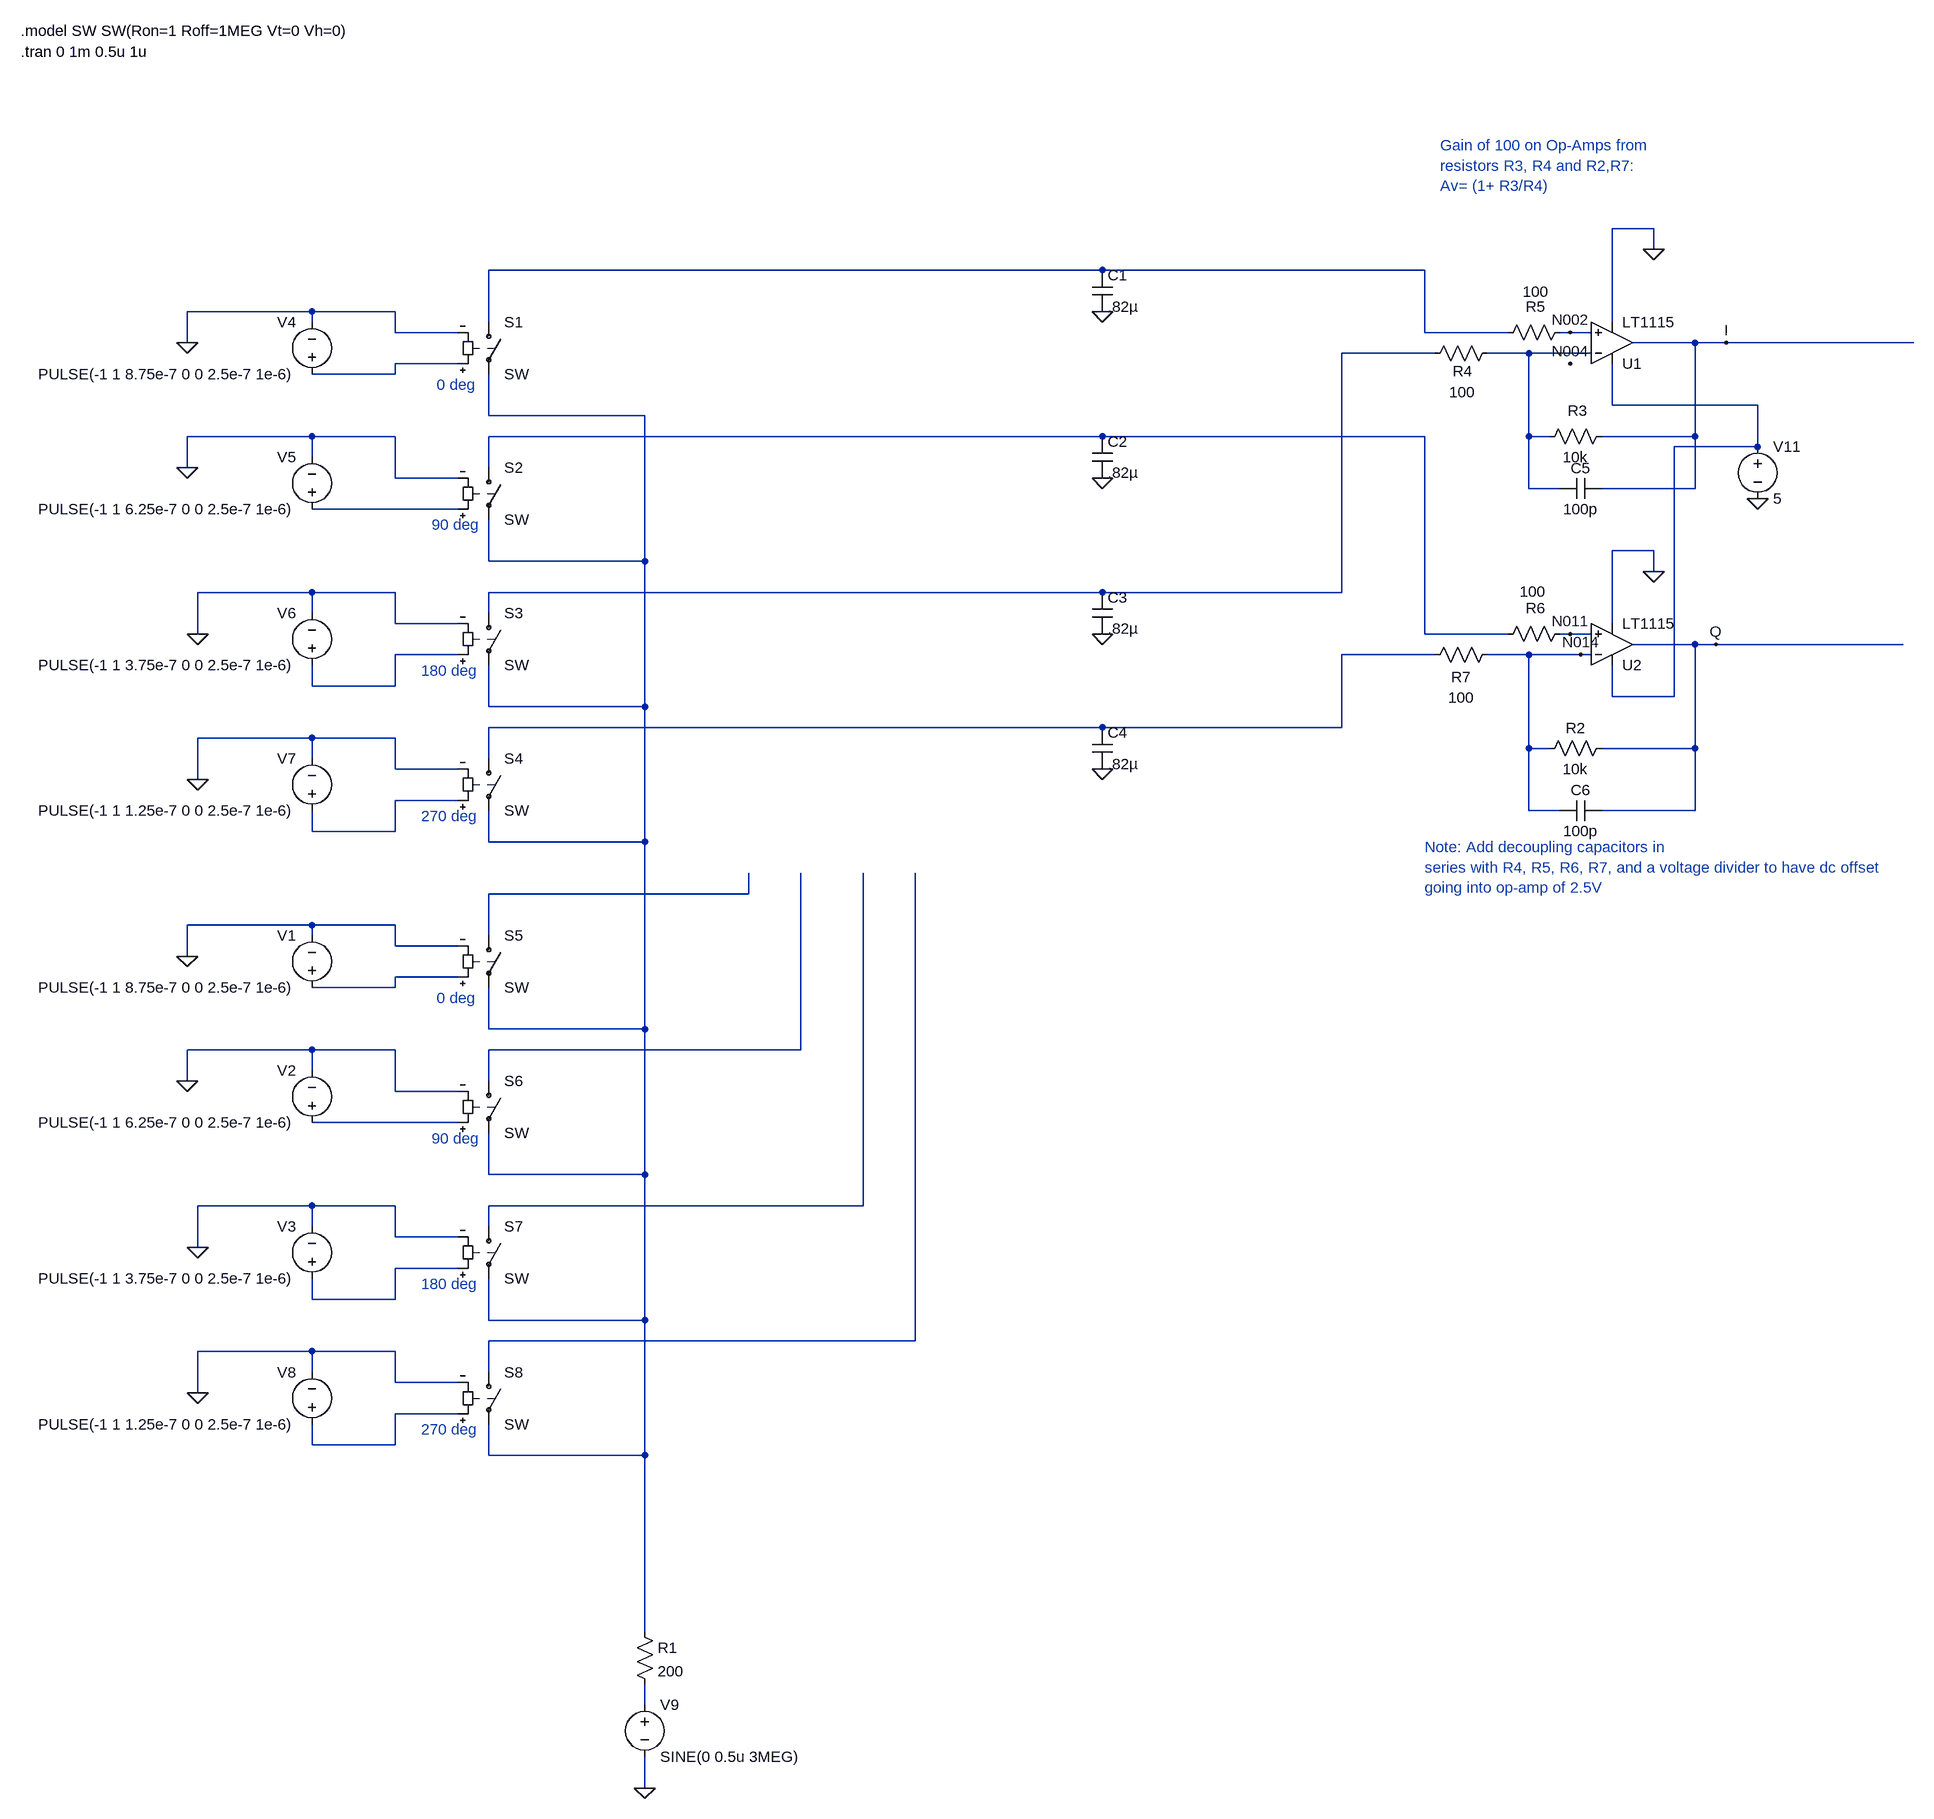
[diagram p0: schematic TayloeMixerSim.asc]
TayloeMixerSim.asc, the LTspice schematic file:
Version 4
SHEET 1 2408 2240
WIRE 1200 -176 1136 -176
WIRE 1200 -144 1200 -176
WIRE 352 -112 -592 -112
WIRE 848 -112 352 -112
WIRE -864 -48 -1056 -48
WIRE -736 -48 -864 -48
WIRE -864 -32 -864 -48
WIRE -592 -32 -592 -112
WIRE 1136 -32 1136 -176
WIRE -736 -16 -736 -48
WIRE -640 -16 -736 -16
WIRE 848 -16 848 -112
WIRE 976 -16 848 -16
WIRE 1072 -16 1056 -16
WIRE 1104 -16 1072 -16
WIRE -1056 0 -1056 -48
WIRE 1264 0 1168 0
WIRE 1312 0 1264 0
WIRE 1600 0 1312 0
WIRE 864 16 720 16
WIRE 1008 16 944 16
WIRE 1104 16 1008 16
WIRE -640 32 -736 32
WIRE -736 48 -736 32
WIRE -736 48 -864 48
WIRE 1136 96 1136 32
WIRE 1360 96 1136 96
WIRE -592 112 -592 48
WIRE -352 112 -592 112
WIRE -864 144 -1056 144
WIRE -736 144 -864 144
WIRE 352 144 -592 144
WIRE 848 144 352 144
WIRE 1008 144 1008 16
WIRE 1040 144 1008 144
WIRE 1264 144 1264 0
WIRE 1264 144 1120 144
WIRE 1360 160 1360 96
WIRE 1360 160 1232 160
WIRE -864 176 -864 144
WIRE -1056 192 -1056 144
WIRE -592 192 -592 144
WIRE -736 208 -736 144
WIRE -640 208 -736 208
WIRE 1008 224 1008 144
WIRE 1056 224 1008 224
WIRE 1264 224 1264 144
WIRE 1264 224 1120 224
WIRE -640 256 -864 256
WIRE 1200 320 1136 320
WIRE -592 336 -592 272
WIRE -352 336 -352 112
WIRE -352 336 -592 336
WIRE 1200 352 1200 320
WIRE -864 384 -1040 384
WIRE -736 384 -864 384
WIRE 352 384 -592 384
WIRE 720 384 720 16
WIRE 720 384 352 384
WIRE -864 416 -864 384
WIRE -592 416 -592 384
WIRE -736 432 -736 384
WIRE -640 432 -736 432
WIRE 1136 432 1136 320
WIRE -1040 448 -1040 384
WIRE 848 448 848 144
WIRE 976 448 848 448
WIRE 1072 448 1056 448
WIRE 1104 448 1072 448
WIRE 1264 464 1168 464
WIRE 1296 464 1264 464
WIRE 1584 464 1296 464
WIRE -640 480 -736 480
WIRE 864 480 720 480
WIRE 1008 480 944 480
WIRE 1088 480 1008 480
WIRE 1104 480 1088 480
WIRE -864 528 -864 496
WIRE -736 528 -736 480
WIRE -736 528 -864 528
WIRE 1136 544 1136 496
WIRE 1232 544 1232 160
WIRE 1232 544 1136 544
WIRE -592 560 -592 496
WIRE -352 560 -352 336
WIRE -352 560 -592 560
WIRE 352 592 -592 592
WIRE 720 592 720 480
WIRE 720 592 352 592
WIRE -864 608 -1040 608
WIRE -736 608 -864 608
WIRE 1008 624 1008 480
WIRE 1040 624 1008 624
WIRE 1264 624 1264 464
WIRE 1264 624 1120 624
WIRE -864 640 -864 608
WIRE -592 640 -592 592
WIRE -736 656 -736 608
WIRE -640 656 -736 656
WIRE -1040 672 -1040 608
WIRE -640 704 -736 704
WIRE 1008 720 1008 624
WIRE 1056 720 1008 720
WIRE 1264 720 1264 624
WIRE 1264 720 1120 720
WIRE -864 752 -864 720
WIRE -736 752 -736 704
WIRE -736 752 -864 752
WIRE -592 768 -592 720
WIRE -352 768 -352 560
WIRE -352 768 -592 768
WIRE -192 848 -192 816
WIRE -192 848 -592 848
WIRE -864 896 -1056 896
WIRE -736 896 -864 896
WIRE -864 912 -864 896
WIRE -592 912 -592 848
WIRE -736 928 -736 896
WIRE -640 928 -736 928
WIRE -1056 944 -1056 896
WIRE -640 976 -736 976
WIRE -736 992 -736 976
WIRE -736 992 -864 992
WIRE -592 1056 -592 992
WIRE -352 1056 -352 768
WIRE -352 1056 -592 1056
WIRE -864 1088 -1056 1088
WIRE -736 1088 -864 1088
WIRE -112 1088 -112 816
WIRE -112 1088 -592 1088
WIRE -864 1120 -864 1088
WIRE -1056 1136 -1056 1088
WIRE -592 1136 -592 1088
WIRE -736 1152 -736 1088
WIRE -640 1152 -736 1152
WIRE -640 1200 -864 1200
WIRE -592 1280 -592 1216
WIRE -352 1280 -352 1056
WIRE -352 1280 -592 1280
WIRE -864 1328 -1040 1328
WIRE -736 1328 -864 1328
WIRE -16 1328 -16 816
WIRE -16 1328 -592 1328
WIRE -864 1360 -864 1328
WIRE -592 1360 -592 1328
WIRE -736 1376 -736 1328
WIRE -640 1376 -736 1376
WIRE -1040 1392 -1040 1328
WIRE -640 1424 -736 1424
WIRE -864 1472 -864 1440
WIRE -736 1472 -736 1424
WIRE -736 1472 -864 1472
WIRE -592 1504 -592 1440
WIRE -352 1504 -352 1280
WIRE -352 1504 -592 1504
WIRE 64 1536 64 816
WIRE 64 1536 -592 1536
WIRE -864 1552 -1040 1552
WIRE -736 1552 -864 1552
WIRE -864 1584 -864 1552
WIRE -592 1584 -592 1536
WIRE -736 1600 -736 1552
WIRE -640 1600 -736 1600
WIRE -1040 1616 -1040 1552
WIRE -640 1648 -736 1648
WIRE -864 1696 -864 1664
WIRE -736 1696 -736 1648
WIRE -736 1696 -864 1696
WIRE -592 1712 -592 1664
WIRE -352 1712 -352 1504
WIRE -352 1712 -592 1712
WIRE -352 1984 -352 1712
WIRE -352 2096 -352 2064
WIRE -352 2224 -352 2176
FLAG -1056 0 0
FLAG -1056 192 0
FLAG -1040 448 0
FLAG -1040 672 0
FLAG -1056 944 0
FLAG -1056 1136 0
FLAG -1040 1392 0
FLAG -1040 1616 0
FLAG -352 2224 0
FLAG 352 -48 0
FLAG 352 208 0
FLAG 352 448 0
FLAG 352 656 0
FLAG 1360 240 0
FLAG 1200 352 0
FLAG 1200 -144 0
FLAG 1296 464 Q
FLAG 1312 0 I
FLAG 1072 -16 N002
FLAG 1072 32 N004
FLAG 1072 448 N011
FLAG 1088 480 N014
SYMBOL sw -592 -48 R0
SYMATTR InstName S1
SYMBOL sw -592 176 R0
SYMATTR InstName S2
SYMBOL sw -592 400 R0
SYMATTR InstName S3
SYMBOL sw -592 624 R0
SYMATTR InstName S4
SYMBOL voltage -864 64 R180
WINDOW 0 24 96 Left 2
WINDOW 3 24 16 Left 2
SYMATTR InstName V4
SYMATTR Value PULSE(-1 1 8.75e-7 0 0 2.5e-7 1e-6)
SYMBOL voltage -864 272 R180
WINDOW 0 24 96 Left 2
WINDOW 3 24 16 Left 2
SYMATTR InstName V5
SYMATTR Value PULSE(-1 1 6.25e-7 0 0 2.5e-7 1e-6)
SYMBOL voltage -864 512 R180
WINDOW 0 24 96 Left 2
WINDOW 3 24 16 Left 2
SYMATTR InstName V6
SYMATTR Value PULSE(-1 1 3.75e-7 0 0 2.5e-7 1e-6)
SYMBOL voltage -864 736 R180
WINDOW 0 24 96 Left 2
WINDOW 3 24 16 Left 2
SYMATTR InstName V7
SYMATTR Value PULSE(-1 1 1.25e-7 0 0 2.5e-7 1e-6)
SYMBOL sw -592 896 R0
SYMATTR InstName S5
SYMBOL sw -592 1120 R0
SYMATTR InstName S6
SYMBOL sw -592 1344 R0
SYMATTR InstName S7
SYMBOL sw -592 1568 R0
SYMATTR InstName S8
SYMBOL voltage -864 1008 R180
WINDOW 0 24 96 Left 2
WINDOW 3 24 16 Left 2
SYMATTR InstName V1
SYMATTR Value PULSE(-1 1 8.75e-7 0 0 2.5e-7 1e-6)
SYMBOL voltage -864 1216 R180
WINDOW 0 24 96 Left 2
WINDOW 3 24 16 Left 2
SYMATTR InstName V2
SYMATTR Value PULSE(-1 1 6.25e-7 0 0 2.5e-7 1e-6)
SYMBOL voltage -864 1456 R180
WINDOW 0 24 96 Left 2
WINDOW 3 24 16 Left 2
SYMATTR InstName V3
SYMATTR Value PULSE(-1 1 3.75e-7 0 0 2.5e-7 1e-6)
SYMBOL voltage -864 1680 R180
WINDOW 0 24 96 Left 2
WINDOW 3 24 16 Left 2
SYMATTR InstName V8
SYMATTR Value PULSE(-1 1 1.25e-7 0 0 2.5e-7 1e-6)
SYMBOL voltage -352 2080 R0
SYMATTR InstName V9
SYMATTR Value SINE(0 0.5u 3MEG)
SYMBOL res -368 1968 R0
SYMATTR InstName R1
SYMATTR Value 200
SYMBOL cap 336 -112 R0
SYMATTR InstName C1
SYMATTR Value .82µ
SYMBOL cap 336 144 R0
SYMATTR InstName C2
SYMATTR Value .82µ
SYMBOL cap 336 384 R0
SYMATTR InstName C3
SYMATTR Value .82µ
SYMBOL cap 336 592 R0
SYMATTR InstName C4
SYMATTR Value .82µ
SYMBOL res 1136 608 R90
WINDOW 0 0 56 VBottom 2
WINDOW 3 32 56 VTop 2
SYMATTR InstName R2
SYMATTR Value 10k
SYMBOL res 1136 128 R90
WINDOW 0 -8 53 VBottom 2
WINDOW 3 32 56 VTop 2
SYMATTR InstName R3
SYMATTR Value 10k
SYMBOL res 960 0 R90
WINDOW 0 59 54 VBottom 2
WINDOW 3 60 54 VTop 2
SYMATTR InstName R4
SYMATTR Value 100
SYMBOL res 1072 -32 R90
WINDOW 0 -8 53 VBottom 2
WINDOW 3 -62 53 VTop 2
SYMATTR InstName R5
SYMATTR Value 100
SYMBOL res 1072 432 R90
WINDOW 0 -8 53 VBottom 2
WINDOW 3 -65 58 VTop 2
SYMATTR InstName R6
SYMATTR Value 100
SYMBOL res 960 464 R90
WINDOW 0 66 56 VBottom 2
WINDOW 3 66 56 VTop 2
SYMATTR InstName R7
SYMATTR Value 100
SYMBOL voltage 1360 144 R0
SYMATTR InstName V11
SYMATTR Value 5
SYMBOL cap 1120 208 R90
WINDOW 0 0 32 VBottom 2
WINDOW 3 32 32 VTop 2
SYMATTR InstName C5
SYMATTR Value 100p
SYMBOL cap 1120 704 R90
WINDOW 0 0 32 VBottom 2
WINDOW 3 32 32 VTop 2
SYMATTR InstName C6
SYMATTR Value 100p
SYMBOL Opamps/LT1115 1136 64 M180
SYMATTR InstName U1
SYMBOL Opamps/LT1115 1136 528 M180
SYMATTR InstName U2
TEXT -672 64 Left 2 ;0 deg
TEXT -680 280 Left 2 ;90 deg
TEXT -696 504 Left 2 ;180 deg
TEXT -696 728 Left 2 ;270 deg
TEXT -1312 -480 Left 2 !.model SW SW(Ron=1 Roff=1MEG Vt=0 Vh=0)
TEXT -1312 -448 Left 2 !.tran 0 1m 0.5u 1u
TEXT -672 1008 Left 2 ;0 deg
TEXT -680 1224 Left 2 ;90 deg
TEXT -696 1448 Left 2 ;180 deg
TEXT -696 1672 Left 2 ;270 deg
TEXT 872 -304 Left 2 ;Gain of 100 on Op-Amps from \nresistors R3, R4 and R2,R7:\nAv= (1+ R3/R4)
TEXT 848 776 Left 2 ;Note: Add decoupling capacitors in \nseries with R4, R5, R6, R7, and a voltage divider to have dc offset\ngoing into op-amp of 2.5V

The netlist it stands for:
* TayloeMixerSim.asc
S1 N001 N008 N006 0 SW
S2 N009 N008 N010 0 SW
S3 N003 N008 N012 0 SW
S4 N013 N008 N015 0 SW
V4 N006 0 PULSE(-1 1 8.75e-7 0 0 2.5e-7 1e-6)
V5 N010 0 PULSE(-1 1 6.25e-7 0 0 2.5e-7 1e-6)
V6 N012 0 PULSE(-1 1 3.75e-7 0 0 2.5e-7 1e-6)
V7 N015 0 PULSE(-1 1 1.25e-7 0 0 2.5e-7 1e-6)
S5 N016 N008 N017 0 SW
S6 N018 N008 N019 0 SW
S7 N020 N008 N021 0 SW
S8 N022 N008 N023 0 SW
V1 N017 0 PULSE(-1 1 8.75e-7 0 0 2.5e-7 1e-6)
V2 N019 0 PULSE(-1 1 6.25e-7 0 0 2.5e-7 1e-6)
V3 N021 0 PULSE(-1 1 3.75e-7 0 0 2.5e-7 1e-6)
V8 N023 0 PULSE(-1 1 1.25e-7 0 0 2.5e-7 1e-6)
V9 N024 0 SINE(0 0.5u 3MEG)
R1 N008 N024 200
C1 N001 0 .82µ
C2 N009 0 .82µ
C3 N003 0 .82µ
C4 N013 0 .82µ
R2 Q N014 10k
R3 I N005 10k
R4 N005 N003 100
R5 N002 N001 100
R6 N011 N009 100
R7 N014 N013 100
V11 N007 0 5
C5 I N005 100p
C6 Q N014 100p
XU1 N002 N005 N007 0 I LT1028  ; LT1115, pins In+ In- V+ V- OUT
XU2 N011 N014 N007 0 Q LT1028  ; LT1115, pins In+ In- V+ V- OUT
* 0 deg
* 90 deg
* 180 deg
* 270 deg
.model SW SW(Ron=1 Roff=1MEG Vt=0 Vh=0)
.tran 0 1m 0.5u 1u
* 0 deg
* 90 deg
* 180 deg
* 270 deg
* Gain of 100 on Op-Amps from
* resistors R3, R4 and R2,R7:
* Av= (1+ R3/R4)
* Note: Add decoupling capacitors in
* series with R4, R5, R6, R7, and a voltage divider to have dc offset
* going into op-amp of 2.5V
.lib LTC.lib
.backanno
.end